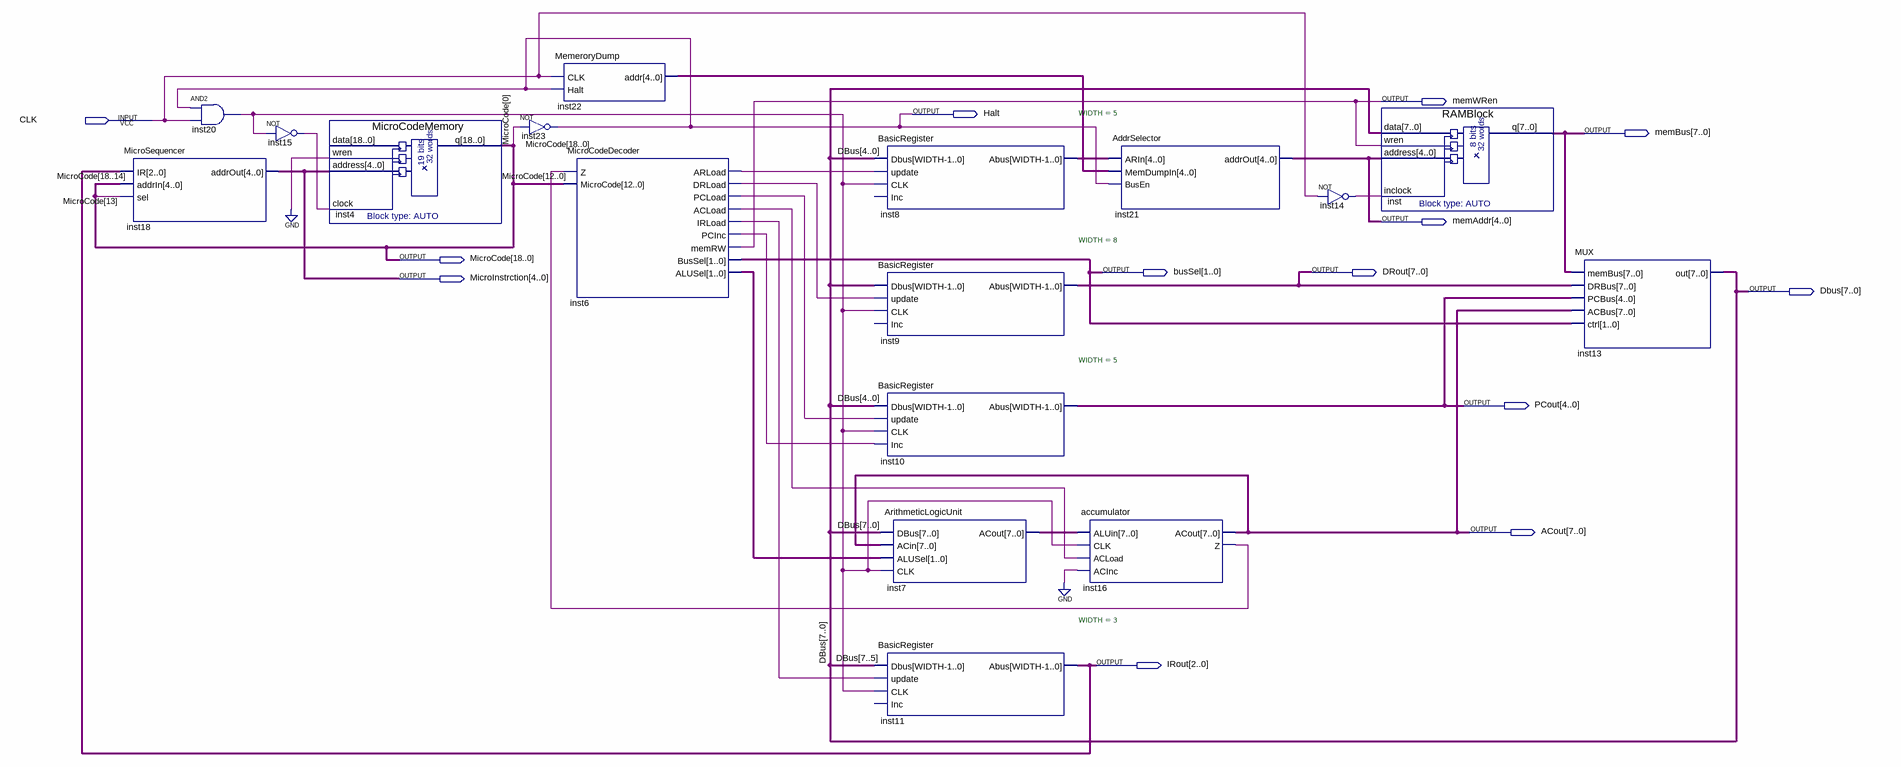
[diagram p0: schematic sheet]
// Quartus schematic comp_org_final_project.bdf as structural Verilog: 17 symbols, 13 pins
module comp_org_final_project (
  input  CLK,
  output memWRen,
  output Halt,
  output [7:0] memBus,
  output [4:0] memAddr,
  output [18:0] MicroCode,
  output [1:0] busSel,
  output [7:0] DRout,
  output [4:0] MicroInstrction,
  output [7:0] Dbus,
  output [4:0] PCout,
  output [7:0] ACout,
  output [2:0] IRout
);

  wire inst6_acload, inst6_arload, inst6_drload, inst6_irload, inst6_pcinc, inst6_pcload, inst14_out,
       inst15_out, inst16_z, inst20_out;
  wire [1:0] inst6_alusel;
  wire [4:0] inst8_abus, inst22_addr;
  wire [7:0] inst7_acout;

  MicroSequencer inst18 (.IR(IRout), .addrIn(MicroCode[18:14]), .sel(MicroCode[13]), .addrOut(MicroInstrction));
  and inst20 (inst20_out, Halt, CLK);
  not inst15 (inst15_out, inst20_out);
  MicroCodeMemory inst4 (.wren(1'b0), .address(MicroInstrction), .clock(inst15_out), .q(MicroCode));  // open: data
  not inst23 (Halt, MicroCode[0]);
  MemeroryDump inst22 (.CLK(CLK), .Halt(Halt), .addr(inst22_addr));
  MicroCodeDecoder inst6 (
    .Z(inst16_z), .MicroCode(MicroCode[12:0]), .ARLoad(inst6_arload), .DRLoad(inst6_drload),
    .PCLoad(inst6_pcload), .ACLoad(inst6_acload), .IRLoad(inst6_irload), .PCInc(inst6_pcinc),
    .memRW(memWRen), .BusSel(busSel), .ALUSel(inst6_alusel));
  BasicRegister #(.WIDTH(5)) inst8 (
    .Dbus(Dbus[4:0]), .update(inst6_arload), .CLK(inst20_out), .Abus(inst8_abus));  // open: Inc
  BasicRegister #(.WIDTH(8)) inst9 (.Dbus(Dbus), .update(inst6_drload), .CLK(inst20_out), .Abus(DRout));  // open: Inc
  BasicRegister #(.WIDTH(5)) inst10 (
    .Dbus(Dbus[4:0]), .update(inst6_pcload), .CLK(inst20_out), .Inc(inst6_pcinc), .Abus(PCout));
  ArithmeticLogicUnit inst7 (.DBus(Dbus), .ACin(ACout), .ALUSel(inst6_alusel), .CLK(inst20_out), .ACout(inst7_acout));
  BasicRegister #(.WIDTH(3)) inst11 (
    .Dbus(Dbus[7:5]), .update(inst6_irload), .CLK(inst20_out), .Abus(IRout));  // open: Inc
  accumulator inst16 (
    .ALUin(inst7_acout), .CLK(inst20_out), .ACLoad(inst6_acload), .ACInc(1'b0), .ACout(ACout), .Z(inst16_z));
  AddrSelector inst21 (.ARIn(inst8_abus), .MemDumpIn(inst22_addr), .BusEn(Halt), .addrOut(memAddr));
  not inst14 (inst14_out, CLK);
  RAMBlock inst (.data(Dbus), .wren(memWRen), .address(memAddr), .inclock(inst14_out), .q(memBus));
  MUX inst13 (.memBus(memBus), .DRBus(DRout), .PCBus(PCout), .ACBus(ACout), .ctrl(busSel), .out(Dbus));
endmodule
